# Altium schematic sheet FUZZY_LOGIC_ARDUINO.SchDoc
size A0
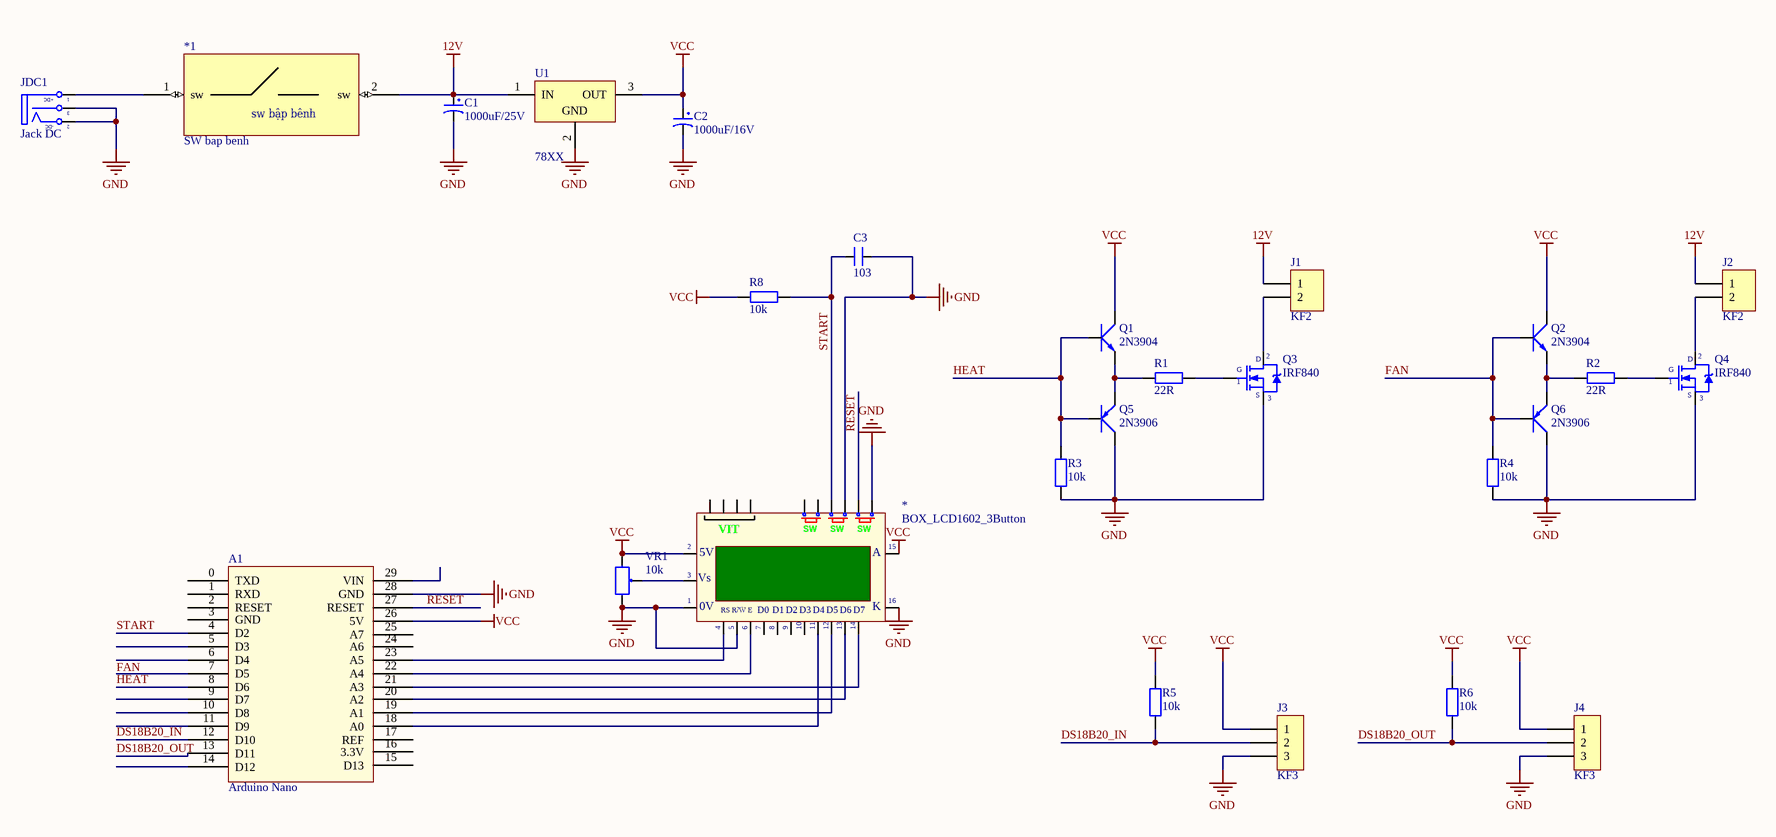
[diagram p0: FUZZY_LOGIC_ARDUINO.SchDoc]

## Parts
*  BOX_LCD1602_3Button  [BOX_LCD1602_3Button]
*1  SW bap benh  [SW bapbenh]
A1  Arduino Nano  [Arduino Nano]
C1  1000uF/25V  [CP1.5/3.4]
C2  1000uF/16V  [CP1.5/3.4]
C3  103  [SM-0805]
J1  KF2  [KF2-3.5]
J2  KF2  [KF2-3.5]
J3  KF3  [KF3-5.08]
J4  KF3  [KF3-5.08]
JDC1  Jack DC  [DC0]
Q1  2N3904  [TO92-123]
Q2  2N3904  [TO92-123]
Q3  IRF840  [TO252-123]
Q4  IRF840  [TO252-123]
Q5  2N3906  [TO92-123]
Q6  2N3906  [TO92-123]
R1  22R  [R1/4W]
R2  22R  [R1/4W]
R3  10k  [SM-RES-0805]
R4  10k  [SM-RES-0805]
R5  10k  [SM-RES-0805]
R6  10k  [SM-RES-0805]
R8  10k  [SM-RES-0805]
U1  78XX  [TO252-123]
VR1  10k  [VR-S2]

## Nets
12V: *1.2(sw) C1.1 J1.1 J2.1 U1.1(IN)
GND: *.1(GND) *.5(R/~{W}) *.16(K) *.20 *.22 A1.28(GND) C1.2 C2.2 C3.2 J3.3 J4.3 JDC1.2(TN) JDC1.3(S) Q3.3(S) Q4.3(S) Q5.3(C) Q6.3(C) R3.1 R4.1 U1.2(GND) VR1.3
VCC: *.2(VDD) *.15(A) A1.26(5V) C2.1 J3.1 J4.1 Q1.3(C) Q2.3(C) R5.2 R6.2 R8.2 U1.3(OUT) VR1.1
DS18B20_IN: A1.12(D10) J3.2 R5.1
DS18B20_OUT: A1.13(D11) J4.2 R6.1
FAN: Q2.2(B) Q6.2(B) R4.2
HEAT: A1.8(D6) Q1.2(B) Q5.2(B) R3.2
RESET: *.21 A1.27(RESET)
START: *.19 A1.4(D2) C3.1 R8.1
Net*1_1: *1.1(sw) JDC1.1(T)
Net*_3: *.3(VEE) VR1.2
Net*_4: *.4(RS) A1.23(A5)
Net*_6: *.6(~{EN}) A1.22(A4)
Net*_11: *.11(D4) A1.18(A0)
Net*_12: *.12(D5) A1.19(A1)
Net*_13: *.13(D6) A1.20(A2)
Net*_14: *.14(D7) A1.21(A3)
NetJ1_2: J1.2 Q3.2(D)
NetJ2_2: J2.2 Q4.2(D)
NetQ1_1: Q1.1(E) Q5.1(E) R1.2
NetQ2_1: Q2.1(E) Q6.1(E) R2.2
NetQ3_1: Q3.1(G) R1.1
NetQ4_1: Q4.1(G) R2.1

Not connected (* = marked no-connect by the designer): * 7(D0) 8(D1) 9(D2) 10(D3) 17 18 23 24 25 26; A1 0(TXD) 1(RXD) 2(RESET) 3(GND) 5(D3) 6(D4) 7(D5) 9(D7) 10(D8) 11(D9) 14(D12) 15(D13) 16(3.3V) 17(REF) 24(A6) 25(A7) 29(VIN)

## Notes on the sheet
- Labels drawn without touching a wire or pin: FAN
- (in symbol BOX_LCD1602_3Button) SW; VIT; 5V; Vs; |; 0V; R/W; E
- (in symbol JACK_DC) +DC; -DC
- (in symbol SW bap benh) sw bập bênh

## Library data of the parts
C1 C2 = CP4: Cap 1000uF/16V - 220uF/50V; Description 5: 4,7uF>10uF/250V_3,3uF>10uF/400V - 2,2uF>4,7uF/450V; Description 1: 2200uF-3300uF/6,3V - 1000uF-2200uF/10V; Description 2: 1000uF/16V - 470uF => 1000uF/25V - 100uF/100V; Description 3: 330uF>470uF/35V_220uF>470uF/50V_10uF>22uF/250V; Description 4: 220uF => 330uF/63V - 10uF =>33uF/160 - 200V; Value: 1000uF/16V
C3 = CM: Cap SMD; Value: 103
J1 J2 = KF2: Manufacturer: Würth Elektronik eiSos GmbH; partNo: 691103110002; ComponentLink1 Description: Manufacturer; ComponentLink2 Description: Datasheet; NoPins: 2; Created Date: 29 October 2013; ComponentLink1URL: http://www.we-online.com; ComponentLink2URL: http://katalog.we-online.de/em/datasheet/6911031100xx.pdf; Created by: Karrer Zheng
J3 J4 = KF3: Manufacturer: Würth Elektronik eiSos GmbH; partNo: 691103110003; ComponentLink1 Description: Manufacturer; ComponentLink2 Description: Datasheet; NoPins: 3; Created Date: 29 October 2013; ComponentLink1URL: http://www.we-online.com; ComponentLink2URL: http://katalog.we-online.de/em/datasheet/6911031100xx.pdf; Created by: Karrer Zheng
JDC1 = JACK_DC
Q1 Q2 = 2N904: NPN 600mW, ECB; Value: C1815
Q3 Q4 = IRF840: MOSFET N - CHANNEL 500V - 0.75 - 8A - TO-220; Value: IRF840
Q5 Q6 = 2N3906: PNP 600mW, ECB; Value: A1015
R1-R6 R8 = R1/4W: Resistor 1/4W; Value: R1/4W - 1K
U1 = LM78XX
VR1 = Resistor Var